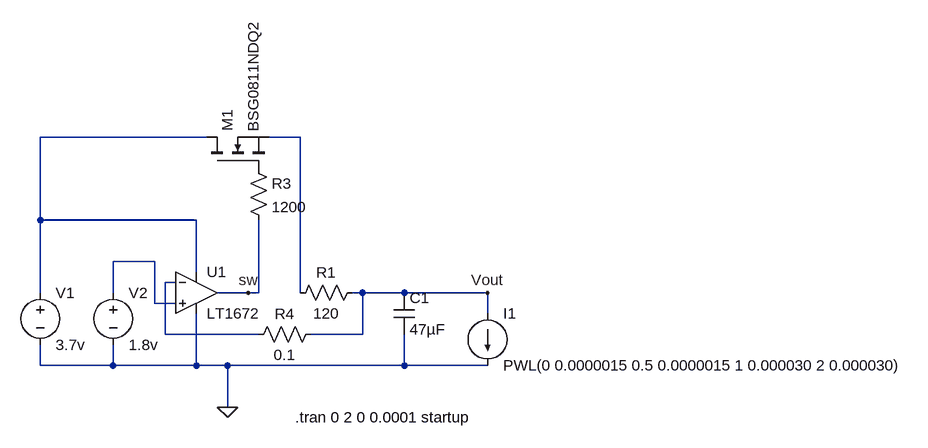
[diagram p0: schematic Switched Capacitor 1v8 step down test.asc]
Switched Capacitor 1v8 step down test.asc, the LTspice schematic file:
Version 4
SHEET 1 1316 680
WIRE 112 64 -144 64
WIRE 256 64 208 64
WIRE -144 192 -144 64
WIRE 96 192 -144 192
WIRE 32 256 -32 256
WIRE 96 272 96 192
WIRE 64 288 48 288
WIRE -144 304 -144 192
WIRE -32 304 -32 256
WIRE 176 304 128 304
WIRE 192 304 192 192
WIRE 192 304 176 304
WIRE 256 304 256 64
WIRE 352 304 336 304
WIRE 416 304 352 304
WIRE 544 304 416 304
WIRE 32 320 32 256
WIRE 64 320 32 320
WIRE 544 336 544 304
WIRE 48 368 48 288
WIRE 192 368 48 368
WIRE 352 368 352 304
WIRE 352 368 272 368
WIRE -144 416 -144 384
WIRE -32 416 -32 384
WIRE -32 416 -144 416
WIRE 96 416 96 336
WIRE 96 416 -32 416
WIRE 144 416 96 416
WIRE 416 416 416 368
WIRE 416 416 144 416
WIRE 544 416 416 416
WIRE 144 480 144 416
FLAG 144 480 0
FLAG 544 304 Vout
FLAG 176 304 sw
SYMBOL cap 400 304 R0
SYMATTR InstName C1
SYMATTR Value 47µF
SYMBOL voltage -144 288 R0
SYMATTR InstName V1
SYMATTR Value 3.7v
SYMBOL res 352 288 R90
WINDOW 0 0 56 VBottom 2
WINDOW 3 32 56 VTop 2
SYMATTR InstName R1
SYMATTR Value 120
SYMBOL Opamps/LT1672 96 304 R0
SYMATTR InstName U1
SYMBOL voltage -32 288 R0
SYMATTR InstName V2
SYMATTR Value 1.8v
SYMBOL nmos 112 112 R270
SYMATTR InstName M1
SYMATTR Value BSG0811NDQ2
SYMBOL res 176 96 R0
SYMATTR InstName R3
SYMATTR Value 1200
SYMBOL res 288 352 R90
WINDOW 0 0 56 VBottom 2
WINDOW 3 32 56 VTop 2
SYMATTR InstName R4
SYMATTR Value 0.1
SYMBOL current 544 336 R0
SYMATTR InstName I1
SYMATTR Value PWL(0 0.0000015 0.5 0.0000015 1 0.000030 2 0.000030)
SYMATTR SpiceLine load
TEXT 248 496 Left 2 !.tran 0 2 0 0.0001 startup

The netlist it stands for:
* Switched Capacitor 1v8 step down test.asc
C1 Vout 0 47µF
V1 N001 0 3.7v
R1 Vout N002 120
* U1: LT1672 (symbol Opamps/LT1672 not available, pins judged from their places): In+=N003 In-=N004 V+=N001 V-=0 OUT=sw
V2 N003 0 1.8v
M1 N001 P001 N002 N002 BSG0811NDQ2
R3 P001 sw 1200
R4 Vout N004 0.1
I1 Vout 0 PWL(0 0.0000015 0.5 0.0000015 1 0.000030 2 0.000030) load
.model NMOS NMOS
.model PMOS PMOS
.lib standard.mos
.tran 0 2 0 0.0001 startup
.backanno
.end